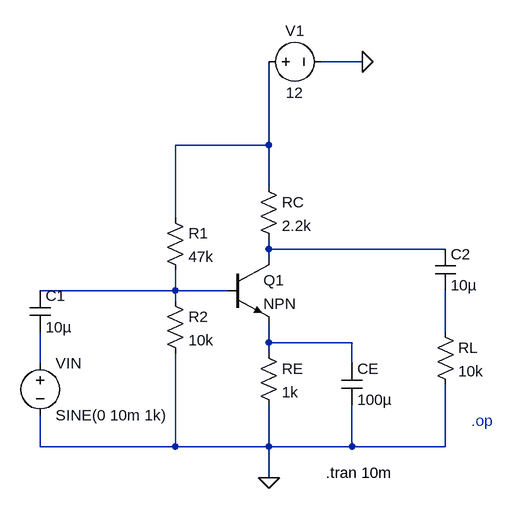
[diagram p0: schematic BJT_Common_Emitter.asc]
BJT_Common_Emitter.asc, the LTspice schematic file:
Version 4.1
SHEET 1 880 680
WIRE 384 -192 320 -192
WIRE 240 -64 240 -192
WIRE 240 -64 96 -64
WIRE 240 0 240 -64
WIRE 96 48 96 -64
WIRE 240 96 240 80
WIRE 512 96 240 96
WIRE 240 112 240 96
WIRE 96 160 96 128
WIRE 96 160 -112 160
WIRE 176 160 96 160
WIRE 96 176 96 160
WIRE 512 224 512 160
WIRE 240 240 240 208
WIRE 368 240 240 240
WIRE 240 256 240 240
WIRE -112 272 -112 224
WIRE 368 272 368 240
WIRE -112 400 -112 352
WIRE 96 400 96 256
WIRE 96 400 -112 400
WIRE 240 400 240 336
WIRE 240 400 96 400
WIRE 368 400 368 336
WIRE 368 400 240 400
WIRE 512 400 512 304
WIRE 512 400 368 400
WIRE 240 448 240 400
FLAG 384 -192 0
FLAG 240 448 0
SYMBOL npn 176 112 R0
SYMATTR InstName Q1
SYMBOL res 80 32 R0
SYMATTR InstName R1
SYMATTR Value 47k
SYMBOL res 80 160 R0
SYMATTR InstName R2
SYMATTR Value 10k
SYMBOL res 224 -16 R0
SYMATTR InstName RC
SYMATTR Value 2.2k
SYMBOL res 224 240 R0
SYMATTR InstName RE
SYMATTR Value 1k
SYMBOL cap 496 96 R0
WINDOW 3 24 56 Left 2
SYMATTR InstName C2
SYMATTR Value 10µ
SYMATTR Description Capacitor
SYMATTR Type cap
SYMATTR SpiceLine V=6.3 Irms=0 Rser=4 Lser=0 mfg="AVX" pn="TAJA106M006" type="Tantalum"
SYMBOL cap -128 160 R0
WINDOW 3 24 56 Left 2
SYMATTR InstName C1
SYMATTR Value 10µ
SYMATTR Description Capacitor
SYMATTR Type cap
SYMATTR SpiceLine V=6.3 Irms=0 Rser=4 Lser=0 mfg="AVX" pn="TAJA106M006" type="Tantalum"
SYMBOL cap 352 272 R0
WINDOW 3 24 56 Left 2
SYMATTR InstName CE
SYMATTR Value 100µ
SYMATTR Description Capacitor
SYMATTR Type cap
SYMATTR SpiceLine V=2 Irms=3 Rser=0.011 Lser=0 mfg="Rubycon" pn="2SXB100M" type="Al electrolytic"
SYMBOL res 496 208 R0
SYMATTR InstName RL
SYMATTR Value 10k
SYMBOL voltage 224 -192 R270
WINDOW 0 32 56 VTop 2
WINDOW 3 -32 56 VBottom 2
WINDOW 123 0 0 Left 0
WINDOW 39 0 0 Left 0
SYMATTR InstName V1
SYMATTR Value 12
SYMBOL voltage -112 256 R0
WINDOW 123 0 0 Left 0
WINDOW 39 0 0 Left 0
SYMATTR InstName VIN
SYMATTR Value SINE(0 10m 1k)
TEXT 552 360 Left 2 ;.op
TEXT 328 440 Left 2 !.tran 10m

The netlist it stands for:
* BJT_Common_Emitter.asc
Q1 N002 N003 N005 0 NPN
R1 N001 N003 47k
R2 N003 0 10k
RC N001 N002 2.2k
RE N005 0 1k
C2 N002 N004 10µ V=6.3 Irms=0 Rser=4 Lser=0 mfg="AVX" pn="TAJA106M006" type="Tantalum"
C1 N003 N006 10µ V=6.3 Irms=0 Rser=4 Lser=0 mfg="AVX" pn="TAJA106M006" type="Tantalum"
CE N005 0 100µ V=2 Irms=3 Rser=0.011 Lser=0 mfg="Rubycon" pn="2SXB100M" type="Al electrolytic"
RL N004 0 10k
V1 N001 0 12
VIN N006 0 SINE(0 10m 1k)
.model NPN NPN
.model PNP PNP
.lib standard.bjt
* .op
.tran 10m
.backanno
.end